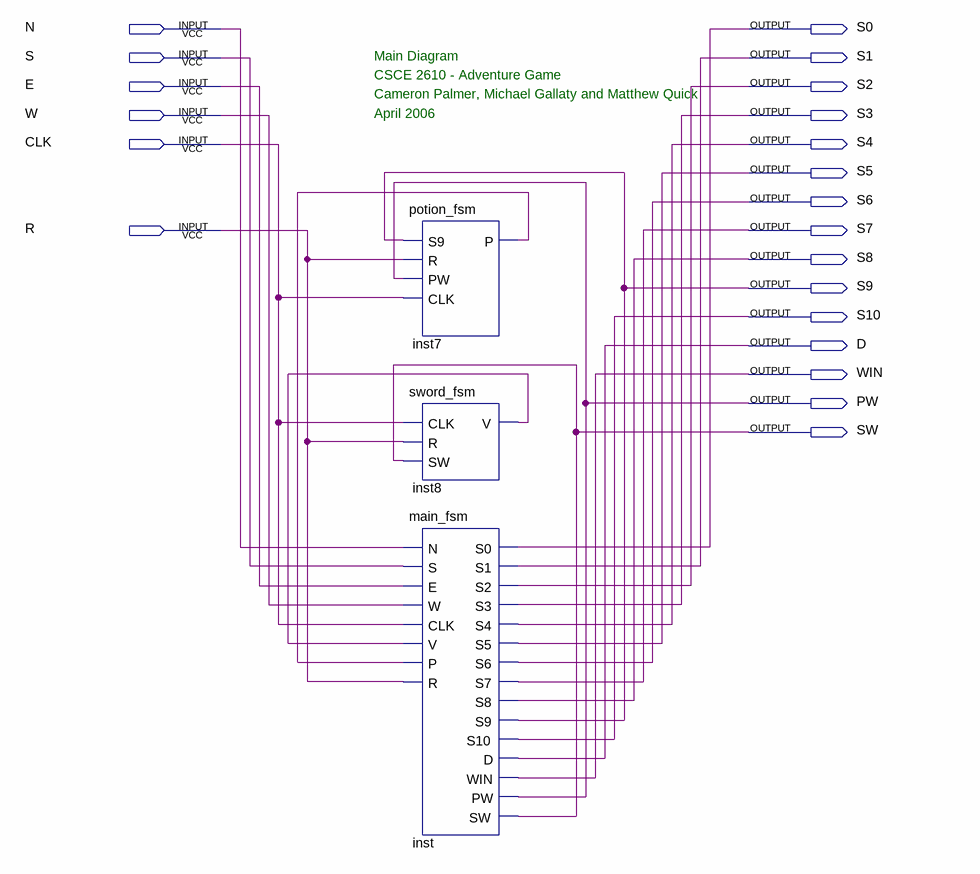
[diagram p0: schematic sheet]
// Quartus schematic adventure.bdf as structural Verilog: 3 symbols, 21 pins
module adventure (
  input  N,
  input  S,
  input  E,
  input  W,
  input  CLK,
  input  R,
  output S0,
  output S1,
  output S2,
  output S3,
  output S4,
  output S5,
  output S6,
  output S7,
  output S8,
  output S9,
  output S10,
  output D,
  output WIN,
  output PW,
  output SW
);

  wire inst7_p, inst8_v;

  potion_fsm inst7 (.S9(S9), .R(R), .PW(PW), .CLK(CLK), .P(inst7_p));
  sword_fsm inst8 (.CLK(CLK), .R(R), .SW(SW), .V(inst8_v));
  main_fsm inst (
    .N(N), .S(S), .E(E), .W(W), .CLK(CLK), .V(inst8_v), .P(inst7_p), .R(R), .S0(S0), .S1(S1), .S2(S2),
    .S3(S3), .S4(S4), .S5(S5), .S6(S6), .S7(S7), .S8(S8), .S9(S9), .S10(S10), .D(D), .WIN(WIN), .PW(PW),
    .SW(SW));

  // Notes on the sheet:
  //   Main Diagram
  //   CSCE 2610 - Adventure Game
  //   Cameron Palmer, Michael Gallaty and Matthew Quick
  //   April 2006
endmodule
